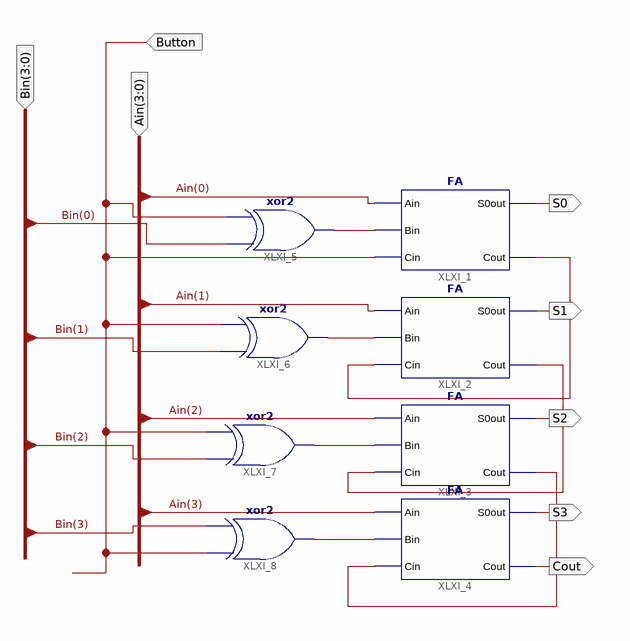
[diagram p0: schematic sheet 1]
// Xilinx ISE schematic Lab5_Exp2.sch (spartan3e) as structural Verilog: 8 symbols, 8 ports
module Lab5_Exp2 (
  input  [3:0] Ain,
  input  [3:0] Bin,
  input  Button,
  output S0,
  output S1,
  output S2,
  output S3,
  output Cout
);

  wire XLXN_6, XLXN_7, XLXN_8, XLXN_19, XLXN_20, XLXN_23, XLXN_25;

  FA XLXI_1 (.Ain(Ain[0]), .Bin(XLXN_19), .Cin(Button), .S0out(S0), .Cout(XLXN_6));
  FA XLXI_2 (.Ain(Ain[1]), .Bin(XLXN_20), .Cin(XLXN_6), .S0out(S1), .Cout(XLXN_7));
  FA XLXI_3 (.Ain(Ain[2]), .Bin(XLXN_23), .Cin(XLXN_7), .S0out(S2), .Cout(XLXN_8));
  FA XLXI_4 (.Ain(Ain[3]), .Bin(XLXN_25), .Cin(XLXN_8), .S0out(S3), .Cout(Cout));
  xor XLXI_5 (XLXN_19, Bin[0], Button);
  xor XLXI_6 (XLXN_20, Bin[1], Button);
  xor XLXI_7 (XLXN_23, Bin[2], Button);
  xor XLXI_8 (XLXN_25, Button, Bin[3]);
endmodule
